# EAGLE design Adafruit Terminal PiCowbell for Pico (EAGLE 9.6.2)
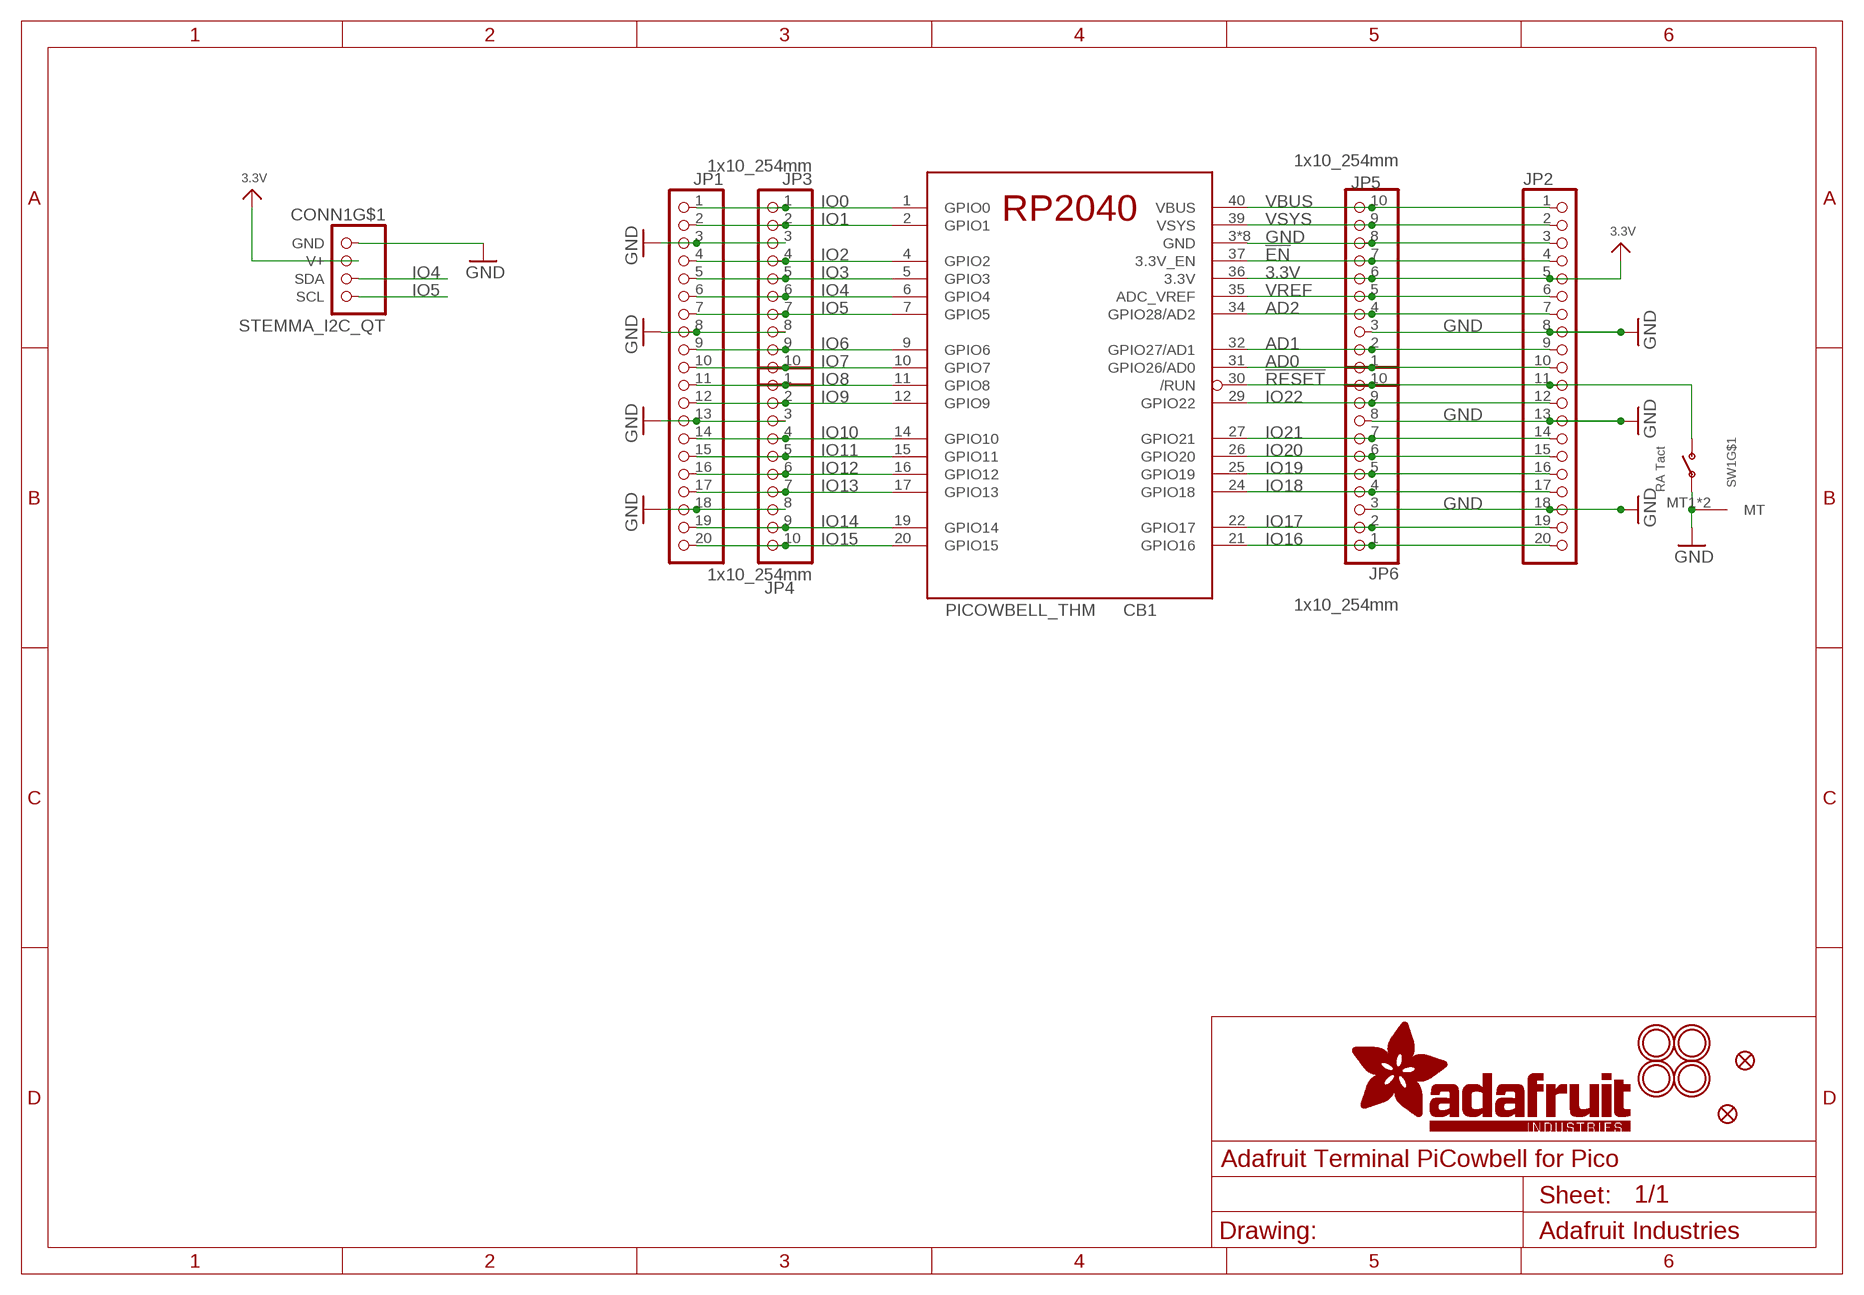
[diagram p0: schematic, sheet 1]

## Parts
CB1  PICOWBELL_THM  [PICOWBELL_THM]
CONN1  STEMMA_I2C_QT  [JST_SH4]
FID1  FIDUCIAL_1MM  [FIDUCIAL_1MM]
FID2  FIDUCIAL_1MM  [FIDUCIAL_1MM]
JP1  HEADER-1X20_70MIL  [1X20_ROUND_70MIL]
JP2  HEADER-1X20_70MIL  [1X20_ROUND_70MIL]
JP3  1x10_254mm  HEADER-1X10_254MM_TERM  [1X10_2.54MMTERMINAL]
JP4  1x10_254mm  HEADER-1X10_254MM_TERM  [1X10_2.54MMTERMINAL]
JP5  1x10_254mm  HEADER-1X10_254MM_TERM  [1X10_2.54MMTERMINAL]
JP6  1x10_254mm  HEADER-1X10_254MM_TERM  [1X10_2.54MMTERMINAL]
SW1  RA Tact  SWITCH_SPST_MNT_TACT_RA  [SPST_TACTILE_RA]
U$5  MOUNTINGHOLE3.0THIN  [MOUNTINGHOLE_3.0_PLATEDTHIN]
U$7  MOUNTINGHOLE3.0THIN  [MOUNTINGHOLE_3.0_PLATEDTHIN]
U$8  MOUNTINGHOLE3.0THIN  [MOUNTINGHOLE_3.0_PLATEDTHIN]
U$9  MOUNTINGHOLE3.0THIN  [MOUNTINGHOLE_3.0_PLATEDTHIN]

## Nets
3.3V: CB1.36(3.3V) CONN1.2(V+) JP2.5 JP5.6
!EN: CB1.37(3.3V_EN) JP2.4 JP5.7
!RESET: CB1.30(/RUN) JP2.11 JP6.10 SW1.2(S)
AD0: CB1.31(GPIO26/AD0) JP2.10 JP5.1
AD1: CB1.32(GPIO27/AD1) JP2.9 JP5.2
AD2: CB1.34(GPIO28/AD2) JP2.7 JP5.4
GND: CB1.3(GND) CB1.8(GND) CB1.13(GND) CB1.18(GND) CB1.23(GND) CB1.28(GND) CB1.33(GND) CB1.38(GND) CONN1.1(GND) JP1.3 JP1.8 JP1.13 JP1.18 JP2.3 JP2.8 JP2.13 JP2.18 JP3.3 JP3.8 JP4.3 JP4.8 JP5.3 JP5.8 JP6.3 JP6.8 SW1.1(P) SW1.MT1(MT) SW1.MT2(MT)
IO0: CB1.1(GPIO0) JP1.1 JP3.1
IO1: CB1.2(GPIO1) JP1.2 JP3.2
IO2: CB1.4(GPIO2) JP1.4 JP3.4
IO3: CB1.5(GPIO3) JP1.5 JP3.5
IO4: CB1.6(GPIO4) CONN1.3(SDA) JP1.6 JP3.6
IO5: CB1.7(GPIO5) CONN1.4(SCL) JP1.7 JP3.7
IO6: CB1.9(GPIO6) JP1.9 JP3.9
IO7: CB1.10(GPIO7) JP1.10 JP3.10
IO8: CB1.11(GPIO8) JP1.11 JP4.1
IO9: CB1.12(GPIO9) JP1.12 JP4.2
IO10: CB1.14(GPIO10) JP1.14 JP4.4
IO11: CB1.15(GPIO11) JP1.15 JP4.5
IO12: CB1.16(GPIO12) JP1.16 JP4.6
IO13: CB1.17(GPIO13) JP1.17 JP4.7
IO14: CB1.19(GPIO14) JP1.19 JP4.9
IO15: CB1.20(GPIO15) JP1.20 JP4.10
IO16: CB1.21(GPIO16) JP2.20 JP6.1
IO17: CB1.22(GPIO17) JP2.19 JP6.2
IO18: CB1.24(GPIO18) JP2.17 JP6.4
IO19: CB1.25(GPIO19) JP2.16 JP6.5
IO20: CB1.26(GPIO20) JP2.15 JP6.6
IO21: CB1.27(GPIO21) JP2.14 JP6.7
IO22: CB1.29(GPIO22) JP2.12 JP6.9
VBUS: CB1.40(VBUS) JP2.1 JP5.10
VREF: CB1.35(ADC_VREF) JP2.6 JP5.5
VSYS: CB1.39(VSYS) JP2.2 JP5.9
Unconnected: CONN1.MT1(MT) CONN1.MT2(MT)

## Library data of the parts
CB1 = adafruit_micro:PICOWBELL
CONN1 = adafruit_electromech:STEMMA_I2C; LCSC: C2845363
FID1 FID2 = microbuilder:FIDUCIAL: Fiducial Alignment Points Various fiducial points for machine vision alignment.; BOM: EXCLUDE
JP1 JP2 = adafruit_electromech:HEADER-1X20
JP3-JP6 = microbuilder:HEADER-1X10: PIN HEADER
SW1 = adafruit_electromech:SWITCH_SPST_MNT: Switch - SPST 4UCon 19192 (6.7x2.6mm SMT); LCSC: C778159
U$5 U$7-U$9 = adafruit_electromech:MOUNTINGHOLE: Mounting Hole For #2 screws (0.086"/2.18mm width, 0.094"/2.4mm hole) use 2.5mm; BOM: EXCLUDE

## Board
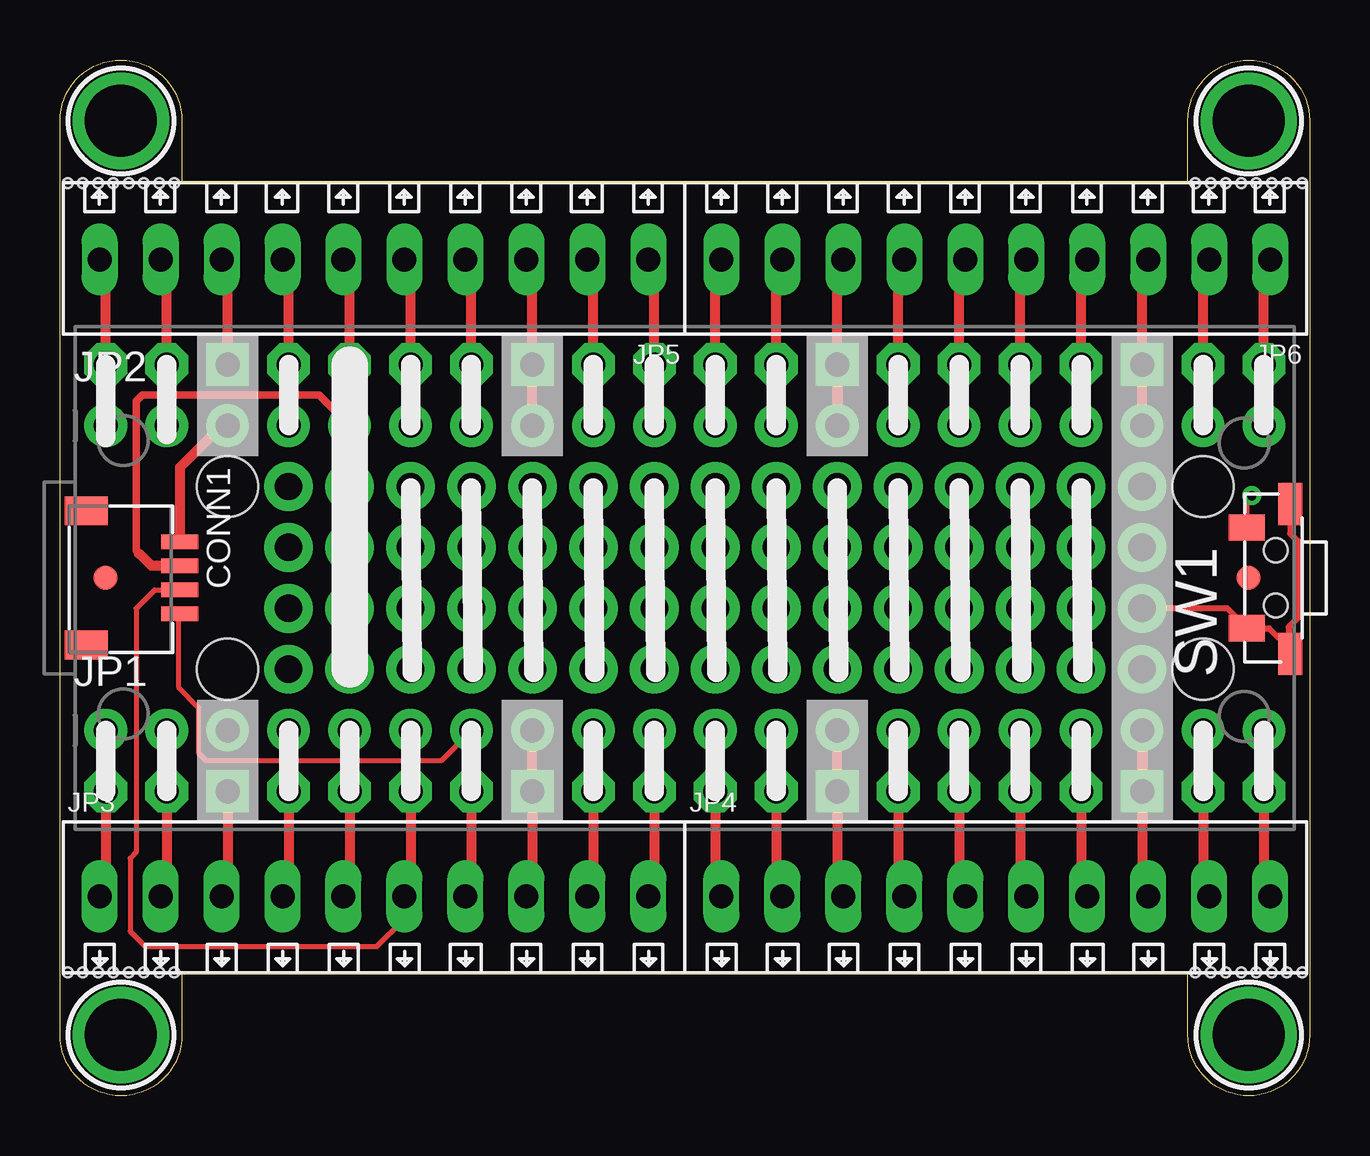
[diagram p1: board, top side]
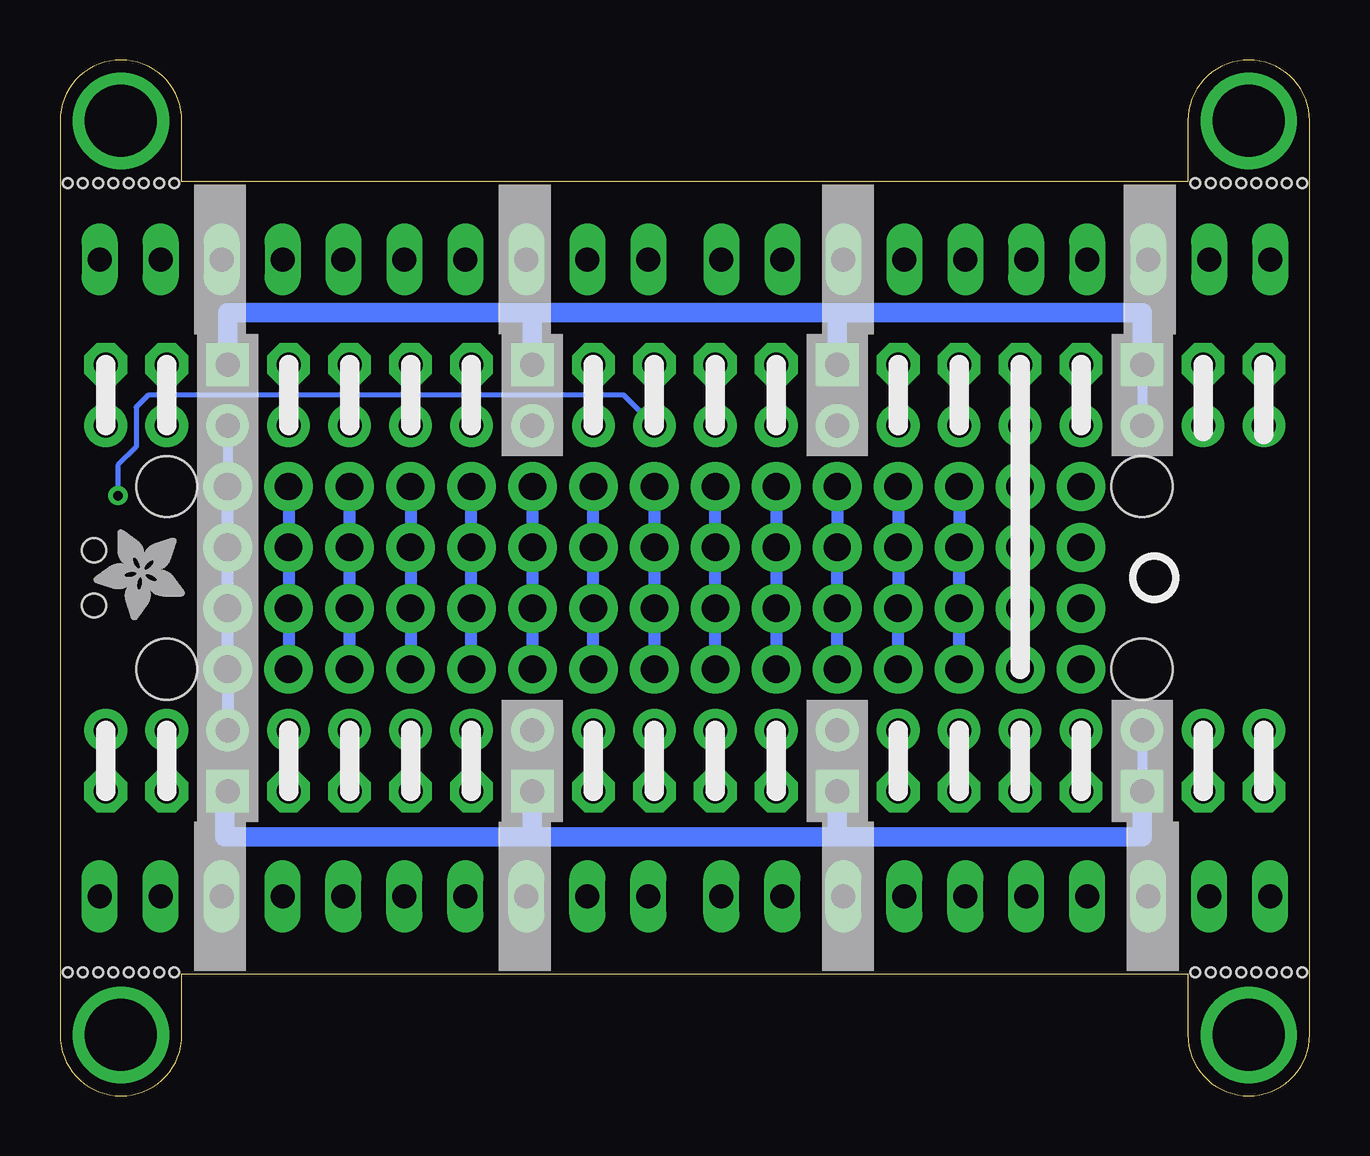
[diagram p2: board, bottom side, seen from below]

Size 52.07 x 43.18 mm. Coordinates in mm from the lower left corner, seen from the top.
Outline: 2.54,0 arc-90 0,2.54 0,40.64 arc-90 2.54,43.18 arc-90 5.08,40.64 5.08,38.1 46.99,38.1 46.99,40.64 arc-90 49.53,43.18 arc-90 52.07,40.64 52.07,2.54 arc-90 49.53,0 arc-90 46.99,2.54 46.99,5.08 5.08,5.08 5.08,2.54 arc-90 2.54,0
Copper layers (1*16): Top 0.035mm / dielectric 1.5mm / Bottom 0.035mm
Design rules "adafruit": minimum track width 8mil, minimum drill 15.5mil, track to track 8mil, track to pad 8mil, pad to pad 8mil, via to via 8mil, smd to smd 8mil, copper to edge 10mil, drill to drill 8mil, minimum pad ring 10mil, minimum via ring 8mil, stop-mask expansion 2mil, vias tented up to drill 20mil, thermal gap 10mil
Holes 2.54 mm at 6.99,25.4 47.62,17.78 47.62,25.4 6.99,17.78
Holes 0.4 mm at 0.32,38.04 0.95,38.04 1.59,38.04 2.22,38.04 2.86,38.04 3.49,38.04 4.13,38.04 4.76,38.04 0.32,5.14 0.95,5.14 1.59,5.14 2.22,5.14 2.86,5.14 3.49,5.14 4.13,5.14 4.76,5.14 47.31,5.14 47.94,5.14 48.58,5.14 49.21,5.14 49.85,5.14 50.48,5.14 51.12,5.14 51.75,5.14 47.31,38.04 47.94,38.04 48.58,38.04 49.21,38.04 49.85,38.04 50.48,38.04 51.12,38.04 51.75,38.04

### Footprints (pad centres in the part's own frame; a part is rotated, then mirrored left to right if it is on the bottom)
PICOWBELL_THM = drill 1 pad 1.778 octagon: 1 -24.13,-8.89; 2 -21.59,-8.89; 4 -16.51,-8.89; 5 -13.97,-8.89; 6 -11.43,-8.89; 7 -8.89,-8.89; 9 -3.81,-8.89; 10 -1.27,-8.89; 11 1.27,-8.89; 12 3.81,-8.89; 14 8.89,-8.89; 15 11.43,-8.89; 16 13.97,-8.89; 17 16.51,-8.89; 19 21.59,-8.89; 20 24.13,-8.89; 21 24.13,8.89; 22 21.59,8.89; 24 16.51,8.89; 25 13.97,8.89; 26 11.43,8.89; 27 8.89,8.89; 29 3.81,8.89; 30 1.27,8.89; 31 -1.27,8.89; 32 -3.81,8.89; 34 -8.89,8.89; 35 -11.43,8.89; 36 -13.97,8.89; 37 -16.51,8.89; 39 -21.59,8.89; 40 -24.13,8.89 | drill 1 pad 1.778 square: 3 -19.05,-8.89; 8 -6.35,-8.89; 13 6.35,-8.89; 18 19.05,-8.89; 23 19.05,8.89; 28 6.35,8.89; 33 -6.35,8.89; 38 -19.05,8.89
JST_SH4 = smd 0.6 x 1.55: 1 -1.5,2.006; 2 -0.5,2.006; 3 0.5,2.006; 4 1.5,2.006 | smd 1.2 x 1.8: MT1 -2.8,-1.894; MT2 2.8,-1.894
FIDUCIAL_1MM = smd 1 x 1: 1 0,0
1X20_ROUND_70MIL = drill 1 pad 1.778: 1 -24.13,0; 2 -21.59,0; 3 -19.05,0; 4 -16.51,0; 5 -13.97,0; 6 -11.43,0; 7 -8.89,0; 8 -6.35,0; 9 -3.81,0; 10 -1.27,0; 11 1.27,0; 12 3.81,0; 13 6.35,0; 14 8.89,0; 15 11.43,0; 16 13.97,0; 17 16.51,0; 18 19.05,0; 19 21.59,0; 20 24.13,0
1X10_2.54MMTERMINAL = drill 1 long: 1 11.43,0; 2 8.89,0; 3 6.35,0; 4 3.81,0; 5 1.27,0; 6 -1.27,0; 7 -3.81,0; 8 -6.35,0; 9 -8.89,0; 10 -11.43,0
SPST_TACTILE_RA = smd 1.1 x 1.5: 1 2.1,-0.9; 2 -2.1,-0.9 | smd 1.75 x 1: MT1 3.175,0.9; MT2 -3.075,0.9 | hole 1: 1.15,0.3; -1.15,0.3
MOUNTINGHOLE_3.0_PLATEDTHIN = drill 3 pad 3.6: P$1 0,0

### Placement (x,y rotation side)
CB1  26.04,21.59 0 top
CONN1  2.98,21.59 270 top
E$1  [ADAFRUIT_3.5MM]  46.86,23.62 180 bottom
FID1  1.91,21.59 0 top
FID2  49.53,21.59 0 top
JP1  26.04,15.24 0 top
JP2  26.04,27.94 0 top
JP3  13.08,8.32 180 top
JP4  38.99,8.32 180 top
JP5  13.08,34.86 0 top
JP6  38.99,34.86 0 top
PLABEL0  [PLABEL0]  47.88,21.59 270 top
PLABEL1  [PLABEL1]  3.43,13.97 0 top
PLABEL2  [PLABEL2]  0.89,13.97 0 top
PLABEL3  [PLABEL3]  8.7,14.03 0 top
PLABEL4  [PLABEL4]  11.05,13.97 0 top
PLABEL5  [PLABEL5]  13.59,13.97 0 top
PLABEL6  [PLABEL6]  16.13,13.97 0 top
PLABEL7  [PLABEL7]  21.4,13.97 0 top
PLABEL8  [PLABEL8]  23.75,13.97 0 top
PLABEL9  [PLABEL9]  26.29,13.97 0 top
PLABEL10  [PLABEL10]  28.83,13.97 0 top
PLABEL11  [PLABEL11]  0.64,29.21 90 top
PLABEL12  [PLABEL12]  3.17,29.21 90 top
PLABEL13  [PLABEL13]  10.79,29.21 90 top
PLABEL14  [PLABEL14]  26.29,29.21 0 top
PLABEL15  [PLABEL15]  50.1,16.83 0 top
PLABEL17  [PLABEL17]  50.1,26.42 0 top
PLABEL19  [PLABEL19]  28.57,29.21 90 top
PLABEL20  [PLABEL20]  36.2,29.21 90 top
PLABEL21  [PLABEL21]  41.27,29.21 90 top
PLABEL22  [PLABEL22]  36.2,13.97 90 top
PLABEL23  [PLABEL23]  41.27,13.97 90 top
PLABEL24  [PLABEL24]  38.73,29.21 90 top
PLABEL25  [PLABEL25]  38.73,13.97 90 top
PLABEL26  [PLABEL26]  23.5,29.15 90 top
PLABEL27  [PLABEL27]  15.81,29.08 90 top
PLABEL28  [PLABEL28]  13.34,29.21 90 top
PLABEL29  [PLABEL29]  0.06,25.27 0 top
PLABEL30  [PLABEL30]  0.13,16.7 0 top
PLABEL35  [PLABEL36]  4.06,5.97 0 bottom
PLABEL36  [PLABEL36]  3.43,13.97 0 bottom
PLABEL37  [PLABEL37]  0.89,13.97 0 bottom
PLABEL38  [PLABEL38]  8.64,14.03 0 bottom
PLABEL39  [PLABEL39]  11.05,13.97 0 bottom
PLABEL40  [PLABEL40]  13.59,13.97 0 bottom
PLABEL41  [PLABEL41]  16.13,13.97 0 bottom
PLABEL42  [PLABEL42]  21.46,13.97 0 bottom
PLABEL43  [PLABEL43]  23.75,13.97 0 bottom
PLABEL44  [PLABEL44]  26.29,13.97 0 bottom
PLABEL45  [PLABEL45]  28.83,13.97 0 bottom
PLABEL46  [PLABEL46]  0.64,29.21 90 bottom
PLABEL47  [PLABEL47]  3.17,29.21 90 bottom
PLABEL48  [PLABEL48]  10.79,29.21 90 bottom
PLABEL49  [PLABEL49]  26.29,29.21 0 bottom
PLABEL50  [PLABEL50]  50.16,16.83 0 bottom
PLABEL52  [PLABEL52]  50.16,26.42 0 bottom
PLABEL54  [PLABEL54]  28.57,29.21 90 bottom
PLABEL55  [PLABEL55]  36.2,29.21 90 bottom
PLABEL56  [PLABEL56]  41.27,29.21 90 bottom
PLABEL57  [PLABEL57]  36.2,13.97 90 bottom
PLABEL58  [PLABEL58]  41.27,13.97 90 bottom
PLABEL59  [PLABEL59]  38.73,29.21 90 bottom
PLABEL60  [PLABEL60]  38.73,13.97 90 bottom
PLABEL61  [PLABEL61]  23.5,29.21 90 bottom
PLABEL62  [PLABEL62]  15.75,29.34 90 bottom
PLABEL63  [PLABEL63]  13.34,29.21 90 bottom
PLABEL64  [PLABEL64]  2.41,21.53 90 bottom
PLABEL65  [PLABEL65]  9.14,37.21 0 bottom
PLABEL66  [PLABEL66]  21.84,37.21 0 bottom
PLABEL67  [PLABEL67]  35.31,37.21 0 bottom
PLABEL68  [PLABEL37]  1.52,5.97 0 bottom
PLABEL69  [PLABEL38]  9.27,5.97 0 bottom
PLABEL70  [PLABEL39]  11.68,5.97 0 bottom
PLABEL71  [PLABEL40]  14.22,5.97 0 bottom
PLABEL72  [PLABEL41]  16.76,5.97 0 bottom
PLABEL73  [PLABEL42]  21.84,5.97 0 bottom
PLABEL74  [PLABEL43]  24.38,5.97 0 bottom
PLABEL75  [PLABEL44]  27.69,5.97 0 bottom
PLABEL76  [PLABEL45]  30.23,5.97 0 bottom
PLABEL77  [PLABEL57]  37.97,5.97 0 bottom
PLABEL78  [PLABEL58]  43.05,5.97 0 bottom
PLABEL79  [PLABEL60]  40.51,5.97 0 bottom
PLABEL80  [PLABEL51]  48.2,5.97 0 bottom
PLABEL81  [PLABEL50]  50.67,5.97 0 bottom
PLABEL82  [PLABEL52]  50.67,37.21 0 bottom
PLABEL83  [PLABEL53]  47.88,37.21 0 bottom
PLABEL84  [PLABEL56]  42.93,37.21 0 bottom
PLABEL85  [PLABEL59]  40.39,37.21 0 bottom
PLABEL86  [PLABEL55]  37.85,37.21 0 bottom
PLABEL87  [PLABEL54]  30.23,37.21 0 bottom
PLABEL88  [PLABEL49]  27.56,37.21 0 bottom
PLABEL89  [PLABEL61]  24.38,37.21 0 bottom
PLABEL90  [PLABEL62]  16.89,37.21 0 bottom
PLABEL91  [PLABEL63]  14.22,37.21 0 bottom
PLABEL92  [PLABEL48]  11.68,37.21 0 bottom
PLABEL93  [PLABEL47]  4.06,37.21 0 bottom
PLABEL94  [PLABEL46]  1.52,37.21 0 bottom
PLABEL688  [PLABEL688]  35.18,5.97 0 bottom
SW1  50.36,21.59 270 top
U$5  2.54,2.54 0 top
U$6  [PCBFEAT-REV-040]  6.48,21.59 90 bottom
U$7  2.54,40.64 0 top
U$8  49.53,2.54 0 top
U$9  49.53,40.64 0 top

### Tracks (layer width: path | path; a pad name or v marks a point on that pad's centre or on a via)
3.3V  (via drill 1.14 pad 2.03)
  Top 0.305: 3.3,22.61 3.17,22.73 3.17,28.96 3.43,29.21 10.79,29.21 JP2.5
  Top 0.406: CB1.36 12.06,34.61 JP5.6 | CONN1.2 3.82,22.09 3.3,22.61
  Top 0.813: CB1.36 JP2.5 v12.06,25.4 v12.06,22.86 v12.06,20.32 v12.06,17.78
!EN
  Top 0.406: CB1.37 9.53,34.61 JP5.7
  Bottom 0.406: CB1.37 JP2.4
!RESET  (via drill 0.39)
  Top 0.254: SW1.2 49.46,24.82 v49.66,25.02
  Top 0.406: JP2.11 CB1.30 27.3,34.61 JP6.10
  Bottom 0.203: JP2.11 28.57,29.21 48.39,29.21 48.9,28.7 48.9,27.05 49.66,26.29 v49.66,25.02
AD0
  Top 0.406: JP2.10 CB1.31 24.77,34.61 JP5.1
AD1
  Top 0.406: JP2.9 CB1.32 22.23,34.61 JP5.2
AD2
  Top 0.406: JP2.7 CB1.34 17.14,34.61 JP5.4
GND  (via drill 1.14 pad 2.03)
  Top 0.254: SW1.MT2 51.26,23.45 51.6,23.11 51.6,19.95 51.19,19.54 51.19,18.67 | SW1.MT1 51.26,18.61 51.19,18.67 | 51.19,18.67 50.37,19.49 SW1.1 48.63,20.32 v45.09,20.32
  Top 0.406: JP1.8 CB1.8 19.68,8.57 JP3.8 | JP1.13 CB1.13 32.38,8.57 JP4.3 | JP1.18 CB1.18 45.09,8.57 JP4.8 | JP2.13 CB1.28 32.38,34.61 JP6.8 | CB1.3 6.99,8.57 JP3.3 | JP2.18 CB1.23 45.09,34.61 JP6.3 | JP2.8 CB1.33 19.68,34.61 JP5.3 | CB1.38 6.99,34.61 JP5.8 | JP2.3 6.73,27.94 4.99,26.2 CONN1.1
  Bottom 0.406: JP1.3 CB1.3 | CB1.38 JP2.3 | JP2.18 v45.09,25.4
  Bottom 0.508: v45.09,25.4 v45.09,22.86 v45.09,20.32 v45.09,17.78 JP1.18
  Bottom 0.813: CB1.38 6.99,32.64 19.68,32.64 | CB1.23 45.09,32.64 32.38,32.64 | 19.68,32.64 32.38,32.64 | CB1.33 19.68,32.64 | CB1.28 32.38,32.64 | CB1.3 6.99,10.79 19.68,10.79 | 19.68,10.79 32.38,10.79 | 32.38,10.79 45.21,10.79 45.21,12.7 CB1.18 | CB1.13 32.38,10.79 | CB1.8 19.68,10.79
IO0
  Top 0.406: JP1.1 CB1.1 1.91,8.57 JP3.1
IO1
  Top 0.406: CB1.2 4.45,8.57 JP3.2
  Bottom 0.406: CB1.2 JP1.2
IO2
  Top 0.406: CB1.4 9.53,8.57 JP3.4
  Bottom 0.406: CB1.4 JP1.4
IO3
  Top 0.406: CB1.5 12.06,8.57 JP3.5
  Bottom 0.406: JP1.5 CB1.5
IO4
  Top 0.203: CONN1.3 3.94,21.09 3.17,20.32 3.17,10.16 2.92,9.91 2.92,6.86 3.56,6.22 13.21,6.22 14.35,7.37 JP3.6
  Top 0.406: CB1.6 14.61,8.57 JP3.6
  Bottom 0.406: CB1.6 JP1.6
IO5
  Top 0.203: JP1.7 15.88,13.97 6.1,13.97 5.79,14.28 5.79,16.18 4.95,17.02 4.95,20.05 CONN1.4
  Top 0.406: CB1.7 17.14,8.57 JP3.7
  Bottom 0.406: JP1.7 CB1.7
IO6
  Top 0.406: JP1.9 CB1.9 22.23,8.57 JP3.9
IO7
  Top 0.406: JP1.10 CB1.10 24.77,8.57 JP3.10
IO8
  Top 0.406: JP1.11 CB1.11 27.3,8.57 JP4.1
IO9
  Top 0.406: JP1.12 CB1.12 29.84,8.57 JP4.2
IO10
  Top 0.406: JP1.14 CB1.14 34.92,8.57 JP4.4
IO11
  Top 0.406: JP1.15 CB1.15 37.47,8.57 JP4.5
IO12
  Top 0.406: JP1.16 CB1.16 40.01,8.57 JP4.6
IO13
  Top 0.406: JP1.17 CB1.17 42.55,8.57 JP4.7
IO14
  Top 0.406: JP1.19 CB1.19 47.62,8.57 JP4.9
IO15
  Top 0.406: JP1.20 CB1.20 50.16,8.57 JP4.10
IO16
  Top 0.406: JP2.20 CB1.21 50.16,34.61 JP6.1
IO17
  Top 0.406: JP2.19 CB1.22 47.62,34.61 JP6.2
IO18
  Top 0.406: JP2.17 CB1.24 42.55,34.61 JP6.4
IO19
  Top 0.406: JP2.16 CB1.25 40.01,34.61 JP6.5
IO20
  Top 0.406: JP2.15 CB1.26 37.47,34.61 JP6.6
IO21
  Top 0.406: JP2.14 CB1.27 34.92,34.61 JP6.7
IO22
  Top 0.406: JP2.12 CB1.29 29.84,34.61 JP6.9
N$49  (via drill 1.14 pad 2.03)
  other vias: 9.53,17.78
N$50  (via drill 1.14 pad 2.03)
  other vias: 9.53,20.32
N$51  (via drill 1.14 pad 2.03)
  other vias: 9.53,22.86
N$52  (via drill 1.14 pad 2.03)
  other vias: 9.53,25.4
PR1  (via drill 1.14 pad 2.03)
  Bottom 0.508: v14.61,25.4 v14.61,22.86 v14.61,20.32 v14.61,17.78
PR2  (via drill 1.14 pad 2.03)
  Bottom 0.508: v17.14,25.4 v17.14,22.86 v17.14,20.32 v17.14,17.78
PR3  (via drill 1.14 pad 2.03)
  Bottom 0.508: v19.68,17.78 v19.68,20.32 v19.68,22.86 v19.68,25.4
PR4  (via drill 1.14 pad 2.03)
  Bottom 0.508: v22.23,25.4 v22.23,22.86 v22.23,20.32 v22.23,17.78
PR5  (via drill 1.14 pad 2.03)
  Bottom 0.508: v24.77,17.78 v24.77,20.32 v24.77,22.86 v24.77,25.4
PR6  (via drill 1.14 pad 2.03)
  Bottom 0.508: v27.3,25.4 v27.3,22.86 v27.3,20.32 v27.3,17.78
PR7  (via drill 1.14 pad 2.03)
  Bottom 0.508: v29.84,17.78 v29.84,20.32 v29.84,22.86 v29.84,25.4
PR8  (via drill 1.14 pad 2.03)
  Bottom 0.508: v32.38,25.4 v32.38,22.86 v32.38,20.32 v32.38,17.78
PR9  (via drill 1.14 pad 2.03)
  Bottom 0.508: v34.92,17.78 v34.92,20.32 v34.92,22.86 v34.92,25.4
PR10  (via drill 1.14 pad 2.03)
  Bottom 0.508: v37.47,25.4 v37.47,22.86 v37.47,20.32 v37.47,17.78
PR11  (via drill 1.14 pad 2.03)
  Bottom 0.508: v40.01,17.78 v40.01,20.32 v40.01,22.86 v40.01,25.4
PR12  (via drill 1.14 pad 2.03)
  Bottom 0.508: v42.55,25.4 v42.55,22.86 v42.55,20.32 v42.55,17.78
VBUS
  Top 0.406: CB1.40 1.91,34.61 JP5.10
  Top 0.813: CB1.40 JP2.1
VREF
  Top 0.406: JP2.6 CB1.35 14.61,34.61 JP5.5
VSYS
  Top 0.406: CB1.39 4.45,34.61 JP5.9
  Bottom 0.813: CB1.39 JP2.2

### Text on the board
Pinguin_tBackup: VB | VS | 3V | Vr | A2 | A0 | R | 22 | 20 | 19 | 18 | 17 | 16 | I2C | G | 3 | RESET | D | C | QT | 0 | 1 | 2 | 3 | 4 | 5 | 6 | 7 | 8 | 9 | 11 | 12 | 13 | 14 | 15
Pinguin_bBackup: EN | A1 | 21 | VB | VS | 3V | Vr | A2 | A0 | R | 22 | 20 | 19 | 18 | 17 | 16 | GN | 3V | Terminal / PiCowbell | Prototyping / PiCowbell | DA | CL | 0 | 1 | 2 | 3 | 4 | 5 | 6 | 7 | 8 | 9 | 11 | 12 | 13 | 14 | 15 | 10